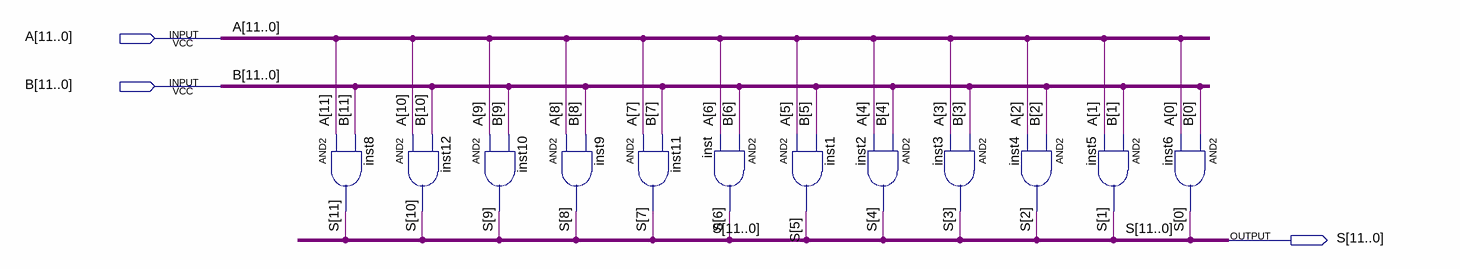
[diagram p0: schematic sheet]
// Quartus schematic And_Eleven_bit.bdf as structural Verilog: 12 symbols, 3 pins
module And_Eleven_bit (
  input  [11:0] A,
  input  [11:0] B,
  output [11:0] S
);

  and inst8 (S[11], A[11], B[11]);
  and inst12 (S[10], A[10], B[10]);
  and inst10 (S[9], A[9], B[9]);
  and inst9 (S[8], A[8], B[8]);
  and inst11 (S[7], A[7], B[7]);
  and inst (S[6], B[6], A[6]);
  and inst1 (S[5], A[5], B[5]);
  and inst2 (S[4], B[4], A[4]);
  and inst3 (S[3], B[3], A[3]);
  and inst4 (S[2], B[2], A[2]);
  and inst5 (S[1], B[1], A[1]);
  and inst6 (S[0], B[0], A[0]);
endmodule
